# EAGLE schematic basis (EAGLE 6.4)
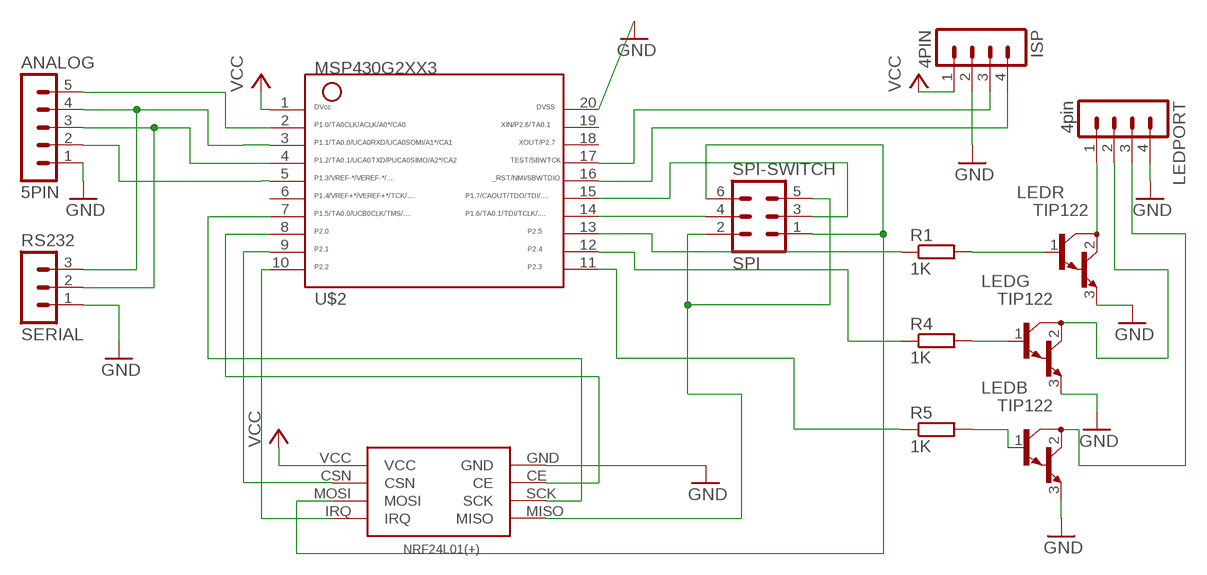
[diagram p0: schematic, sheet 1]

## Parts
ANALOG  5PIN  MA05-1  [MA05-1]
ISP  4PIN  MA04-1  [MA04-1]
LEDB  TIP122  [TO220]
LEDG  TIP122  [TO220]
LEDPORT  4pin  MA04-1  [MA04-1]
LEDR  TIP122  [TO220]
R1  1K  R-EU_0414/15  [0414/15]
R4  1K  R-EU_0414/15  [0414/15]
R5  1K  R-EU_0414/15  [0414/15]
RS232  SERIAL  MA03-1  [MA03-1]
SPI-SWITCH  SPI  MA03-2  [MA03-2]
U$1  NFR24L01+-PRINT  [MINI-PCB]
U$2  G2XX3---N20  [N20]

## Nets
_REST: ISP.4 U$2.16
GND: ANALOG.1 ISP.2 LEDB.3(E) LEDG.3(E) LEDPORT.4 LEDR.3(E) RS232.1 U$1.GND U$2.20
N$1: U$1.SCK U$2.7
N$2: SPI-SWITCH.2 SPI-SWITCH.5 U$1.MISO
N$3: SPI-SWITCH.4 U$2.14
N$4: U$1.CE U$2.8
N$6: U$1.CSN U$2.9
N$7: U$1.IRQ U$2.10
N$9: SPI-SWITCH.3 U$2.15
N$11: SPI-SWITCH.1 SPI-SWITCH.6 U$1.MOSI
N$12: ANALOG.5 U$2.2
N$13: ANALOG.4 RS232.3 U$2.3
N$14: ANALOG.3 RS232.2 U$2.4
N$15: ANALOG.2 U$2.5
N$16: LEDR.1(B) R1.2
N$17: LEDG.1(B) R4.2
N$18: LEDB.1(B) R5.2
N$19: R1.1 U$2.13
N$20: R4.1 U$2.12
N$21: R5.1 U$2.11
N$22: LEDPORT.1 LEDR.2(C)
N$23: LEDG.2(C) LEDPORT.2
N$24: LEDB.2(C) LEDPORT.3
TEST: ISP.3 U$2.17
VCC: ISP.1 U$1.VCC U$2.1
Unconnected: U$2.6 U$2.18 U$2.19

## Library data of the parts
ANALOG = con-lstb:MA05-1: PIN HEADER; OC_FARNELL: unknown; OC_NEWARK: unknown
ISP LEDPORT = con-lstb:MA04-1: PIN HEADER; OC_FARNELL: unknown; OC_NEWARK: unknown
LEDB LEDG LEDR = transistor-npn:TIP122*: NPN Darlington Transistor
R1 R4 R5 = rcl:R-EU_: RESISTOR, European symbol
RS232 = con-lstb:MA03-1: PIN HEADER; OC_FARNELL: unknown; OC_NEWARK: unknown
SPI-SWITCH = con-lstb:MA03-2: PIN HEADER; OC_FARNELL: unknown; OC_NEWARK: unknown
U$1 = vincents-lib:NFR24L01+-PRINT
U$2 = TI_MSP430_v16:G2XX3---N20: MSP430G2XX1 PDIP (N) 20 Pin Package